# EAGLE schematic Numitron3 (EAGLE 9.2.1)
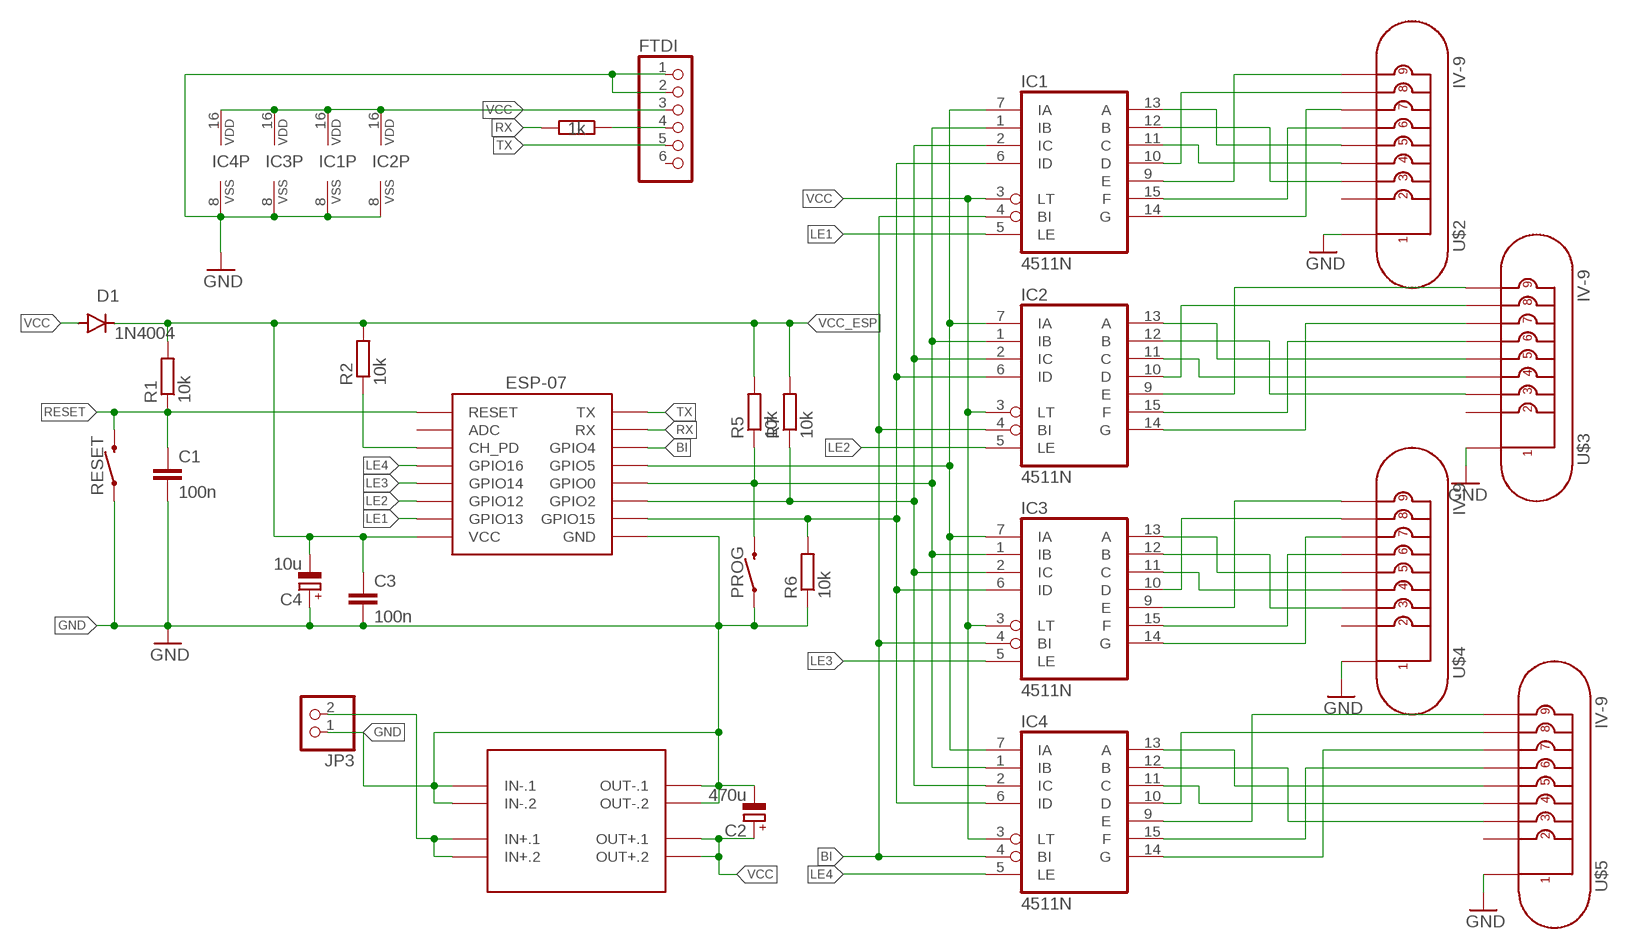
[diagram p0: schematic, sheet 1]

## Parts
C1  100n  C-EU025-024X044  [C025-024X044]
C2  470u  CPOL-EUB45181B  [B45181B]
C3  100n  C-EU025-050X050  [C025-050X050]
C4  10u  CPOL-EUB45181A  [B45181A]
D1  1N4004  [DO41-10]
ESP-07  ESP12SMD  [ESP12-SMD]
FTDI  PINHD-1X6  [1X06]
IC1  4511N  [DIL16]
IC2  4511N  [DIL16]
IC3  4511N  [DIL16]
IC4  4511N  [DIL16]
JP3  PINHD-1X2  [1X02]
PROG  MOMENTARY-SWITCH-SPST-PTH-6.0MM  [TACTILE_SWITCH_PTH_6.0MM]
R1  10k  R-EU_0204/7  [0204/7]
R2  10k  R-EU_0204/7  [0204/7]
R4  1k  R-EU_0204/7  [0204/7]
R5  10k  R-EU_0204/7  [0204/7]
R6  10k  R-EU_0204/7  [0204/7]
R7  10k  R-EU_0204/7  [0204/7]
RESET  MOMENTARY-SWITCH-SPST-PTH-6.0MM  [TACTILE_SWITCH_PTH_6.0MM]
U$2  IV-9  [IV-9]
U$3  IV-9  [IV-9]
U$4  IV-9  [IV-9]
U$5  IV-9  [IV-9]
U$6  DC-DC-STEP-DOWN-MP1584  [DC-DC-STEP-DOWN-MP1584]

## Nets
BI: ESP-07.GPIO4 IC1.4(BI) IC2.4(BI) IC3.4(BI) IC4.4(BI)
GND [power]: C1.2 C2.- C3.2 C4.+ ESP-07.GND FTDI.1 FTDI.2 IC1.8(VSS) IC2.8(VSS) IC3.8(VSS) IC4.8(VSS) JP3.1 PROG.1 R6.1 RESET.1 U$2.1 U$3.1 U$4.1 U$5.1 U$6.IN-.1 U$6.IN-.2 U$6.OUT-.1 U$6.OUT-.2
LE1: ESP-07.GPIO13 IC1.5(LE)
LE2: ESP-07.GPIO12 IC2.5(LE)
LE3: ESP-07.GPIO14 IC3.5(LE)
LE4: ESP-07.GPIO16 IC4.5(LE)
N$1: ESP-07.GPIO5 IC1.7(IA) IC2.7(IA) IC3.7(IA) IC4.7(IA)
N$2: ESP-07.GPIO0 IC1.1(IB) IC2.1(IB) IC3.1(IB) IC4.1(IB) PROG.3 R5.1
N$3: ESP-07.GPIO2 IC1.2(IC) IC2.2(IC) IC3.2(IC) IC4.2(IC) R7.1
N$4: ESP-07.GPIO15 IC1.6(ID) IC2.6(ID) IC3.6(ID) IC4.6(ID) R6.2
N$5: IC1.13(A) U$2.5
N$6: IC1.12(B) U$2.3
N$7: IC1.11(C) U$2.4
N$8: IC1.10(D) U$2.8
N$9: IC1.9(E) U$2.9
N$10: IC1.15(F) U$2.6
N$11: IC1.14(G) U$2.7
N$12: IC2.14(G) U$3.7
N$13: IC2.12(B) U$3.3
N$14: IC2.13(A) U$3.5
N$15: IC2.10(D) U$3.8
N$16: IC2.9(E) U$3.9
N$17: IC2.11(C) U$3.4
N$18: IC2.15(F) U$3.6
N$19: IC3.9(E) U$4.9
N$20: IC3.13(A) U$4.5
N$21: IC3.12(B) U$4.3
N$22: IC3.15(F) U$4.6
N$23: IC3.14(G) U$4.7
N$24: IC3.10(D) U$4.8
N$25: IC3.11(C) U$4.4
N$26: IC4.14(G) U$5.7
N$27: IC4.15(F) U$5.6
N$28: IC4.9(E) U$5.9
N$29: IC4.10(D) U$5.8
N$30: IC4.11(C) U$5.4
N$31: IC4.12(B) U$5.3
N$32: IC4.13(A) U$5.5
N$33: ESP-07.CH_PD R2.1
N$37 [power]: JP3.2 U$6.IN+.1 U$6.IN+.2
N$39: FTDI.4 R4.1
RESET: C1.1 ESP-07.RESET R1.1 RESET.3
RX: ESP-07.RXD0(RX) R4.2
TX: ESP-07.TXD0(TX) FTDI.5
VCC [power]: C2.+ D1.A FTDI.3 IC1.3(LT) IC1.16(VDD) IC2.3(LT) IC2.16(VDD) IC3.3(LT) IC3.16(VDD) IC4.3(LT) IC4.16(VDD) U$6.OUT+.1 U$6.OUT+.2
VCC_ESP [power]: C3.1 C4.- D1.C ESP-07.VCC R1.2 R2.2 R5.2 R7.2
Unconnected: ESP-07.ADC FTDI.6 U$2.2 U$3.2 U$4.2 U$5.2

## Library data of the parts
C1 C3 = rcl:C-EU: CAPACITOR, European symbol; SPICEPREFIX: C
C2 C4 = rcl:CPOL-EU: POLARIZED CAPACITOR, European symbol; SPICEPREFIX: C
D1 = diode:1N4004: DIODE general purpose rectifier, 1 A
ESP-07 = esp8266modules:ESP12: ESP8266 Wifi module 12
FTDI = adafruit:PINHD-1X6: PIN HEADER
IC1-IC4 = 45xx:4511: BCD to 7-segment LATCH/DECODER/DRIVER
JP3 = pinhead:PINHD-1X2: PIN HEADER
PROG RESET = SparkFun-Switches:MOMENTARY-SWITCH-SPST: Momentary Switch (Pushbutton) - SPST Normally-open (NO) SPST momentary switches (buttons, pushbuttons). Variants PTH-12MM - 12mm square, through-hole Momentary Pushbutton Switch - 12mm Square <https://www.sparkfun.com/products/9190> (COM-09190) PTH-6.0MM, PTH-6.0MM-KIT - 6.0mm square, through-hole Mini Pushbutton Switch <https://www.sparkfun.com/products/97> (COM-00097) KIT package intended for soldering kit's - only one side of pads' copper is exposed. PTH-RIGHT-ANGLE-KIT - Right-angle, through-hole Right Angle Tactile Button <https://www.sparkfun.com/products/10791> - Used on SparkFun BigTime Watch Kit <https://www.sparkfun.com/products/11734> SMD-12MM - 12mm square, surface-mount Tactile Button - SMD (12mm) <https://www.sparkfun.com/products/12993> (COM-12993) Used on SparkFun PicoBoard <https://www.sparkfun.com/products/11888> SMD-4.5MM - 4.5mm Square Trackball Switch Used on SparkFun Blackberry Trackballer Breakout <https://www.sparkfun.com/products/13169> SMD-4.6MMX2.8MM - 4.60mm x 2.80mm, surface mount Used on SparkFun SAMD21 Mini Breakout <https://www.sparkfun.com/products/13664> SMD-5.2MM, SMD-5.2-REDUNDANT - 5.2mm square, surface-mount Mini Pushbutton Switch - SMD <https://www.sparkfun.com/products/8720> (COM-08720) Used on Arduino Pro Mini <https://www.sparkfun.com/products/11114> REDUNDANT package connects both switch circuits together SMD-6.0X3.5MM - 6.0 x 3.5mm, surface mount Momentary Reset Switch SMD <https://www.sparkfun.com/products/8229> (COM-08229) SMD-6.2MM-TALL - 6.2mm square, surface mount Tactile Button - SMD (6mm) <https://www.sparkfun.com/products/12992> Used on SparkFun Digital Sandbox <https://www.sparkfun.com/products/12651> SMD-RIGHT-ANGLE - Right-angle, surface mount Used on SparkFun Block for Intel® Edison - Arduino <https://www.sparkfun.com/products/13036>; PROD_ID: SWCH-08441; SF_SKU: COM-00097
R1 R2 R4-R7 = rcl:R-EU_: RESISTOR, European symbol; SPICEPREFIX: R
U$2-U$5 = domestichacks:IV-9
U$6 = diy-modules:DC-DC-STEP-DOWN-MP1584: DC/DC Step-Down Regulator based on MP1584 chip MP1584 datasheet available here: http://www.haoyuelectronics.com/Attachment/MP1584/MP1584.pdf Click here to find device on ebay.com <http://www.ebay.com/sch/mp1584+module>

## Net classes
1 power: width 0.508 mm, clearance 0.305 mm